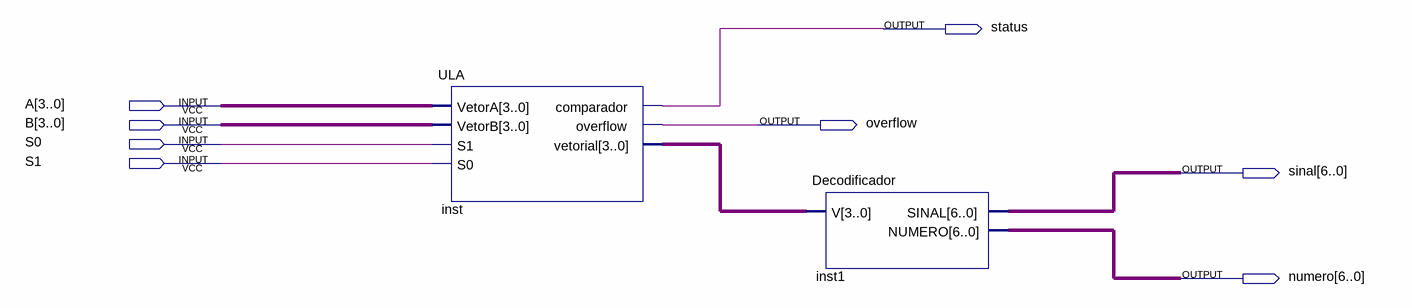
[diagram p0: schematic sheet]
// Quartus schematic ULA_Oficial.bdf as structural Verilog: 2 symbols, 8 pins
module ULA_Oficial (
  input  [3:0] A,
  input  [3:0] B,
  input  S0,
  input  S1,
  output status,
  output overflow,
  output [6:0] sinal,
  output [6:0] numero
);

  wire [3:0] inst_vetorial;

  ULA inst (
    .VetorA(A), .VetorB(B), .S1(S0), .S0(S1), .comparador(status), .overflow(overflow),
    .vetorial(inst_vetorial));
  Decodificador inst1 (.V(inst_vetorial), .SINAL(sinal), .NUMERO(numero));
endmodule
